# EAGLE schematic DAQ and eCVT (EAGLE 9.5.0)

## Sheet 1 of 3
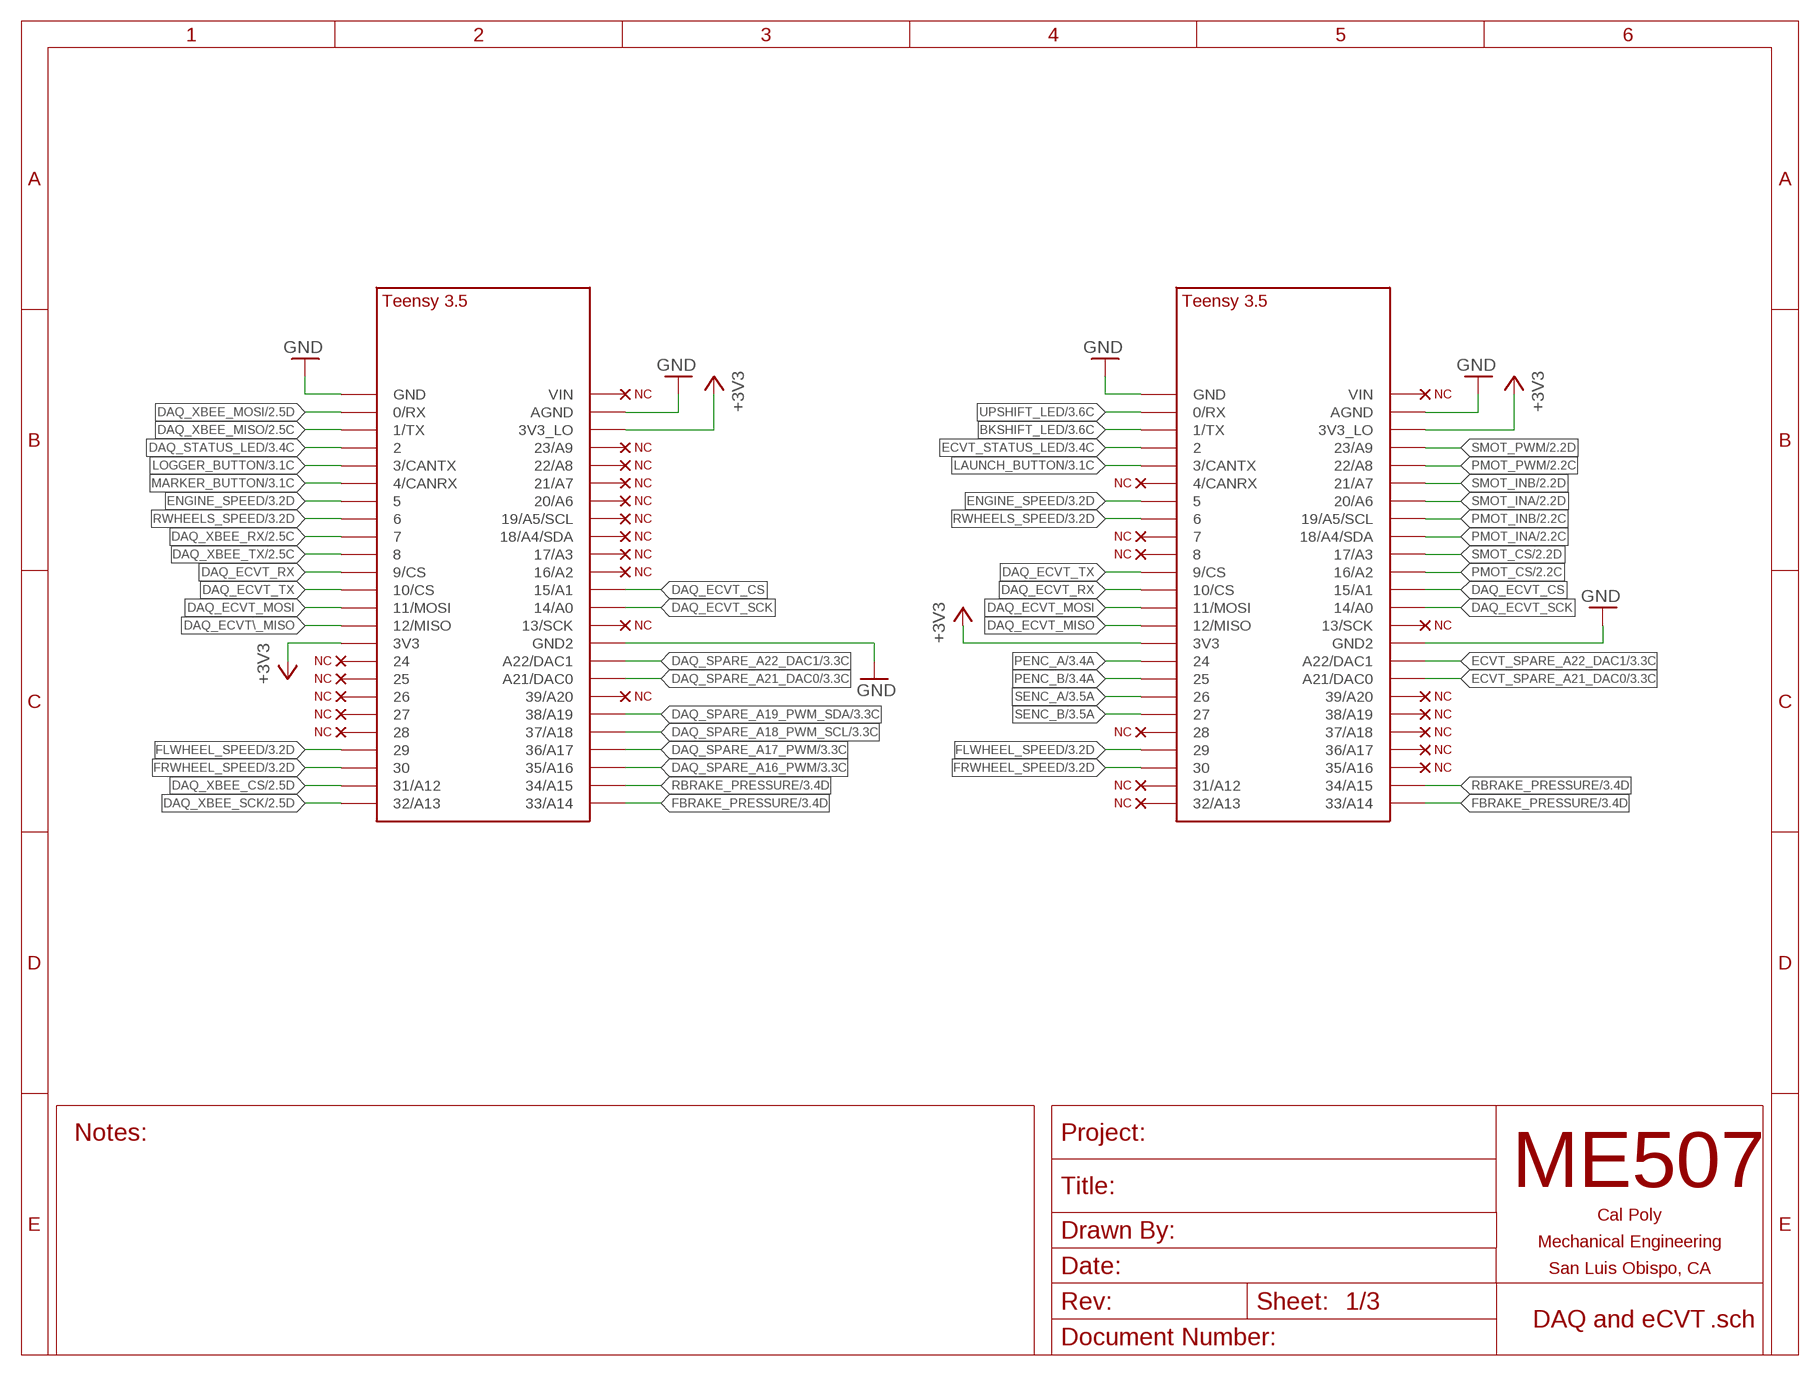
[diagram p0: schematic, sheet 1]

### Parts
U$1  NC  (no package)
U$2  NC  (no package)
U$3  NC  (no package)
U$4  NC  (no package)
U$5  NC  (no package)
U$6  NC  (no package)
U$7  NC  (no package)
U$8  NC  (no package)
U$9  NC  (no package)
U$10  NC  (no package)
U$11  NC  (no package)
U$12  NC  (no package)
U$13  NC  (no package)
U$14  NC  (no package)
U$15  NC  (no package)
U$16  NC  (no package)
U$17  NC  (no package)
U$22  NC  (no package)
U$23  NC  (no package)
U$24  NC  (no package)
U$25  NC  (no package)
U$26  NC  (no package)
U$27  NC  (no package)
U$31  TEENSY_3.5_BAJA  [TEENSY_3.5_BAJA]
U$32  NC  (no package)
U$33  TEENSY_3.5_BAJA  [TEENSY_3.5_BAJA]
U$40  NC  (no package)
U$41  NC  (no package)
U$42  NC  (no package)
U$55  NC  (no package)
U$56  NC  (no package)

### Nets
+3V3: U$31.3V3_LO U$33.3V3_LO ; also sheet 2,3
BKSHIFT_LED: U$33.1/TX ; also sheet 3
DAQ_ECVT\_MISO: U$31.12/MISO
DAQ_ECVT_CS: U$31.15/A1 U$33.15/A1
DAQ_ECVT_MISO: U$33.12/MISO
DAQ_ECVT_MOSI: U$31.11/MOSI U$33.11/MOSI
DAQ_ECVT_RX: U$31.9/CS U$33.10/CS
DAQ_ECVT_SCK: U$31.14/A0 U$33.14/A0
DAQ_ECVT_TX: U$31.10/CS U$33.9/CS
DAQ_SPARE_A16_PWM: U$31.35/A16 ; also sheet 3
DAQ_SPARE_A17_PWM: U$31.36/A17 ; also sheet 3
DAQ_SPARE_A18_PWM_SCL: U$31.37/A18 ; also sheet 3
DAQ_SPARE_A19_PWM_SDA: U$31.38/A19 ; also sheet 3
DAQ_SPARE_A21_DAC0: U$31.21/DAC0(A21/DAC0) ; also sheet 3
DAQ_SPARE_A22_DAC1: U$31.A22/DAC1 ; also sheet 3
DAQ_STATUS_LED: U$31.2 ; also sheet 3
DAQ_XBEE_CS: U$31.31/A12 ; also sheet 2
DAQ_XBEE_MISO: U$31.1/TX ; also sheet 2
DAQ_XBEE_MOSI: U$31.0/RX ; also sheet 2
DAQ_XBEE_RX: U$31.7 ; also sheet 2
DAQ_XBEE_SCK: U$31.32/A13 ; also sheet 2
DAQ_XBEE_TX: U$31.8 ; also sheet 2
ECVT_SPARE_A21_DAC0: U$33.21/DAC0(A21/DAC0) ; also sheet 3
ECVT_SPARE_A22_DAC1: U$33.A22/DAC1 ; also sheet 3
ECVT_STATUS_LED: U$33.2 ; also sheet 3
ENGINE_SPEED: U$31.5 U$33.5 ; also sheet 3
FBRAKE_PRESSURE: U$31.33/A14 U$33.33/A14 ; also sheet 3
FLWHEEL_SPEED: U$31.29 U$33.29 ; also sheet 3
FRWHEEL_SPEED: U$31.30 U$33.30 ; also sheet 3
GND: U$31.AGND U$31.GND U$31.GND2 U$33.AGND U$33.GND U$33.GND2 ; also sheet 2,3
LAUNCH_BUTTON: U$33.3/CANTX ; also sheet 3
LOGGER_BUTTON: U$31.3/CANTX ; also sheet 3
MARKER_BUTTON: U$31.4/CANRX ; also sheet 3
N$2: U$31.3V3 ; supply symbol labelled +3V3
N$3: U$4.D U$31.13/SCK
N$4: U$5.D U$31.16/A2
N$5: U$6.D U$31.17/A3
N$6: U$7.D U$31.18/A4/SDA
N$7: U$8.D U$31.19/A5/SCL
N$8: U$9.D U$31.20/A6
N$9: U$10.D U$31.21/A7
N$10: U$11.D U$31.22/A8
N$11: U$12.D U$31.23/A9
N$12: U$13.D U$31.24
N$13: U$14.D U$31.25
N$14: U$15.D U$31.26
N$15: U$16.D U$31.27
N$16: U$17.D U$31.28
N$17: U$22.D U$31.39/A20
N$18: U$31.VIN U$56.D
N$19: U$33.3V3 ; supply symbol labelled +3V3
N$20: U$3.D U$33.13/SCK
N$22: U$33.39/A20 U$40.D
N$23: U$33.7 U$41.D
N$24: U$33.8 U$42.D
N$25: U$23.D U$33.28
N$26: U$24.D U$33.35/A16
N$27: U$25.D U$33.36/A17
N$28: U$26.D U$33.37/A18
N$29: U$27.D U$33.38/A19
N$30: U$33.VIN U$55.D
N$31: U$1.D U$33.4/CANRX
N$32: U$2.D U$33.31/A12
N$33: U$32.D U$33.32/A13
PENC_A: U$33.24 ; also sheet 3
PENC_B: U$33.25 ; also sheet 3
PMOT_CS: U$33.16/A2 ; also sheet 2
PMOT_INA: U$33.18/A4/SDA ; also sheet 2
PMOT_INB: U$33.19/A5/SCL ; also sheet 2
PMOT_PWM: U$33.22/A8 ; also sheet 2
RBRAKE_PRESSURE: U$31.34/A15 U$33.34/A15 ; also sheet 3
RWHEELS_SPEED: U$31.6 U$33.6 ; also sheet 3
SENC_A: U$33.26 ; also sheet 3
SENC_B: U$33.27 ; also sheet 3
SMOT_CS: U$33.17/A3 ; also sheet 2
SMOT_INA: U$33.20/A6 ; also sheet 2
SMOT_INB: U$33.21/A7 ; also sheet 2
SMOT_PWM: U$33.23/A9 ; also sheet 2
UPSHIFT_LED: U$33.0/RX ; also sheet 3

## Sheet 2 of 3
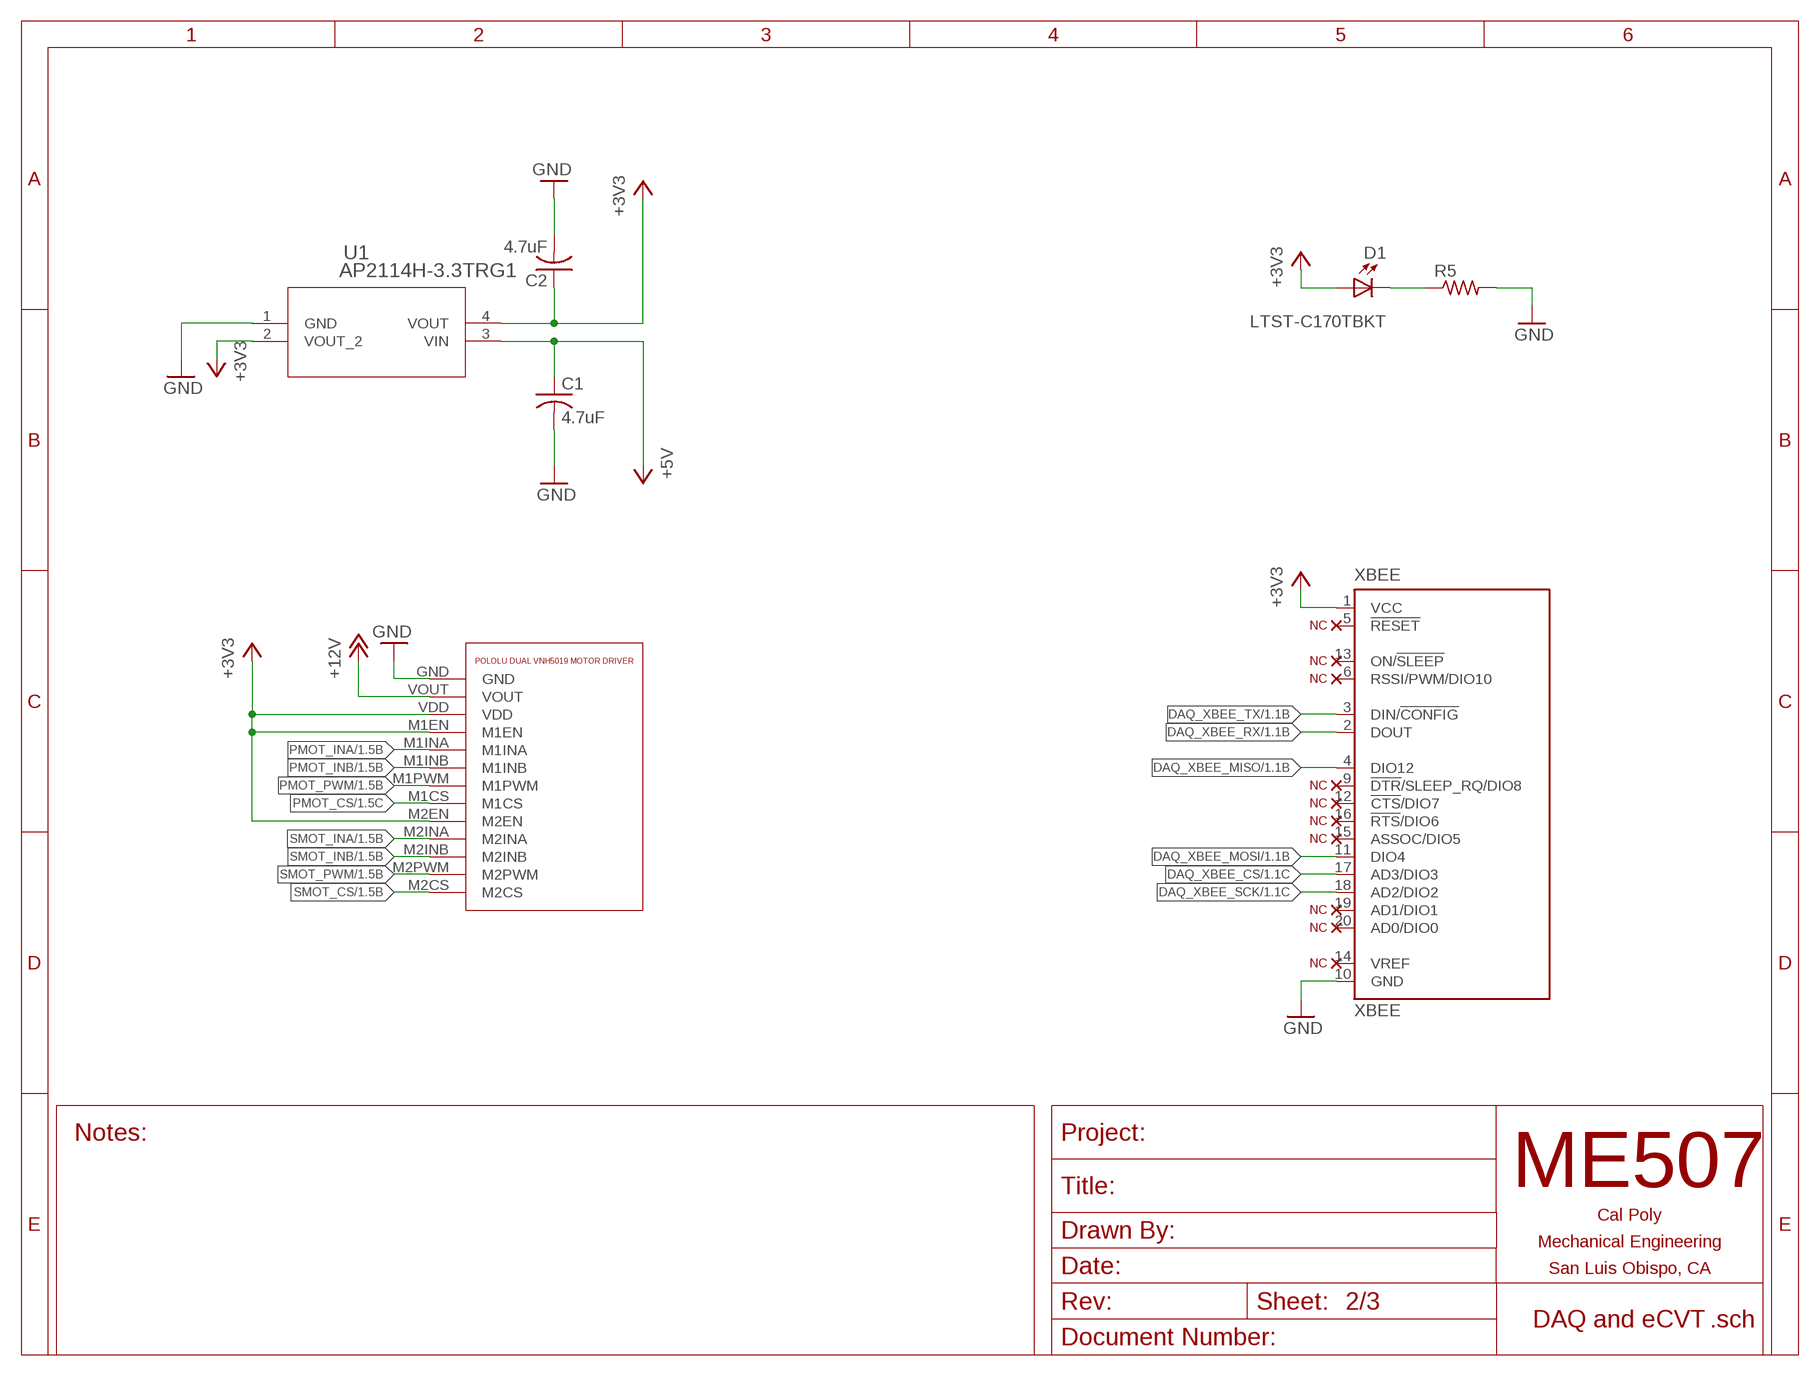
[diagram p1: schematic, sheet 2]

### Parts
C1  4.7uF  C-USC0805  [C0805]
C2  4.7uF  C-USC0805  [C0805]
D1  LTST-C170TBKT  [DIOC200X125X110]
R5  R-US_R0805  [R0805]
U1  AP2114H-3.3TRG1  [SOT-223]
U$28  POLOLU_DUAL_VNH5019_BAJA  [POLOLU_DUAL_VNH5019_BAJA]
U$34  NC  (no package)
U$35  NC  (no package)
U$47  NC  (no package)
U$48  NC  (no package)
U$49  NC  (no package)
U$50  NC  (no package)
U$51  NC  (no package)
U$52  NC  (no package)
U$53  NC  (no package)
U$54  NC  (no package)
XBEE  XBEE  [XBEE]

### Nets
+3V3: C2.1 D1.+ U1.2(VOUT_2) U1.4(VOUT) U$28.M1EN U$28.M2EN U$28.VDD XBEE.1(VCC) ; also sheet 1,3
+5V: C1.1 U1.3(VIN) ; also sheet 3
+12V: U$28.VOUT ; also sheet 3
DAQ_XBEE_CS: XBEE.17(AD3/DIO3) ; also sheet 1
DAQ_XBEE_MISO: XBEE.4(DIO12) ; also sheet 1
DAQ_XBEE_MOSI: XBEE.11(DIO4) ; also sheet 1
DAQ_XBEE_RX: XBEE.2(DOUT) ; also sheet 1
DAQ_XBEE_SCK: XBEE.18(AD2/DIO2) ; also sheet 1
DAQ_XBEE_TX: XBEE.3(DIN/!CONFIG) ; also sheet 1
GND: C1.2 C2.2 R5.2 U1.1(GND) U$28.GND XBEE.10(GND) ; also sheet 1,3
N$34: D1.- R5.1
N$43: U$34.D XBEE.5(!RESET)
N$45: U$35.D XBEE.13(ON/!SLEEP)
N$46: U$47.D XBEE.6(RSSI/PWM/DIO10)
N$47: U$48.D XBEE.9(!DTR!/SLEEP_RQ/DIO8)
N$48: U$49.D XBEE.12(!CTS!/DIO7)
N$49: U$50.D XBEE.16(!RTS!/DIO6)
N$50: U$51.D XBEE.15(ASSOC/DIO5)
N$51: U$52.D XBEE.19(AD1/DIO1)
N$52: U$53.D XBEE.20(AD0/DIO0)
N$53: U$54.D XBEE.14(VREF)
PMOT_CS: U$28.M1CS ; also sheet 1
PMOT_INA: U$28.M1INA ; also sheet 1
PMOT_INB: U$28.M1INB ; also sheet 1
PMOT_PWM: U$28.M1PWM ; also sheet 1
SMOT_CS: U$28.M2CS ; also sheet 1
SMOT_INA: U$28.M2INA ; also sheet 1
SMOT_INB: U$28.M2INB ; also sheet 1
SMOT_PWM: U$28.M2PWM ; also sheet 1

## Sheet 3 of 3
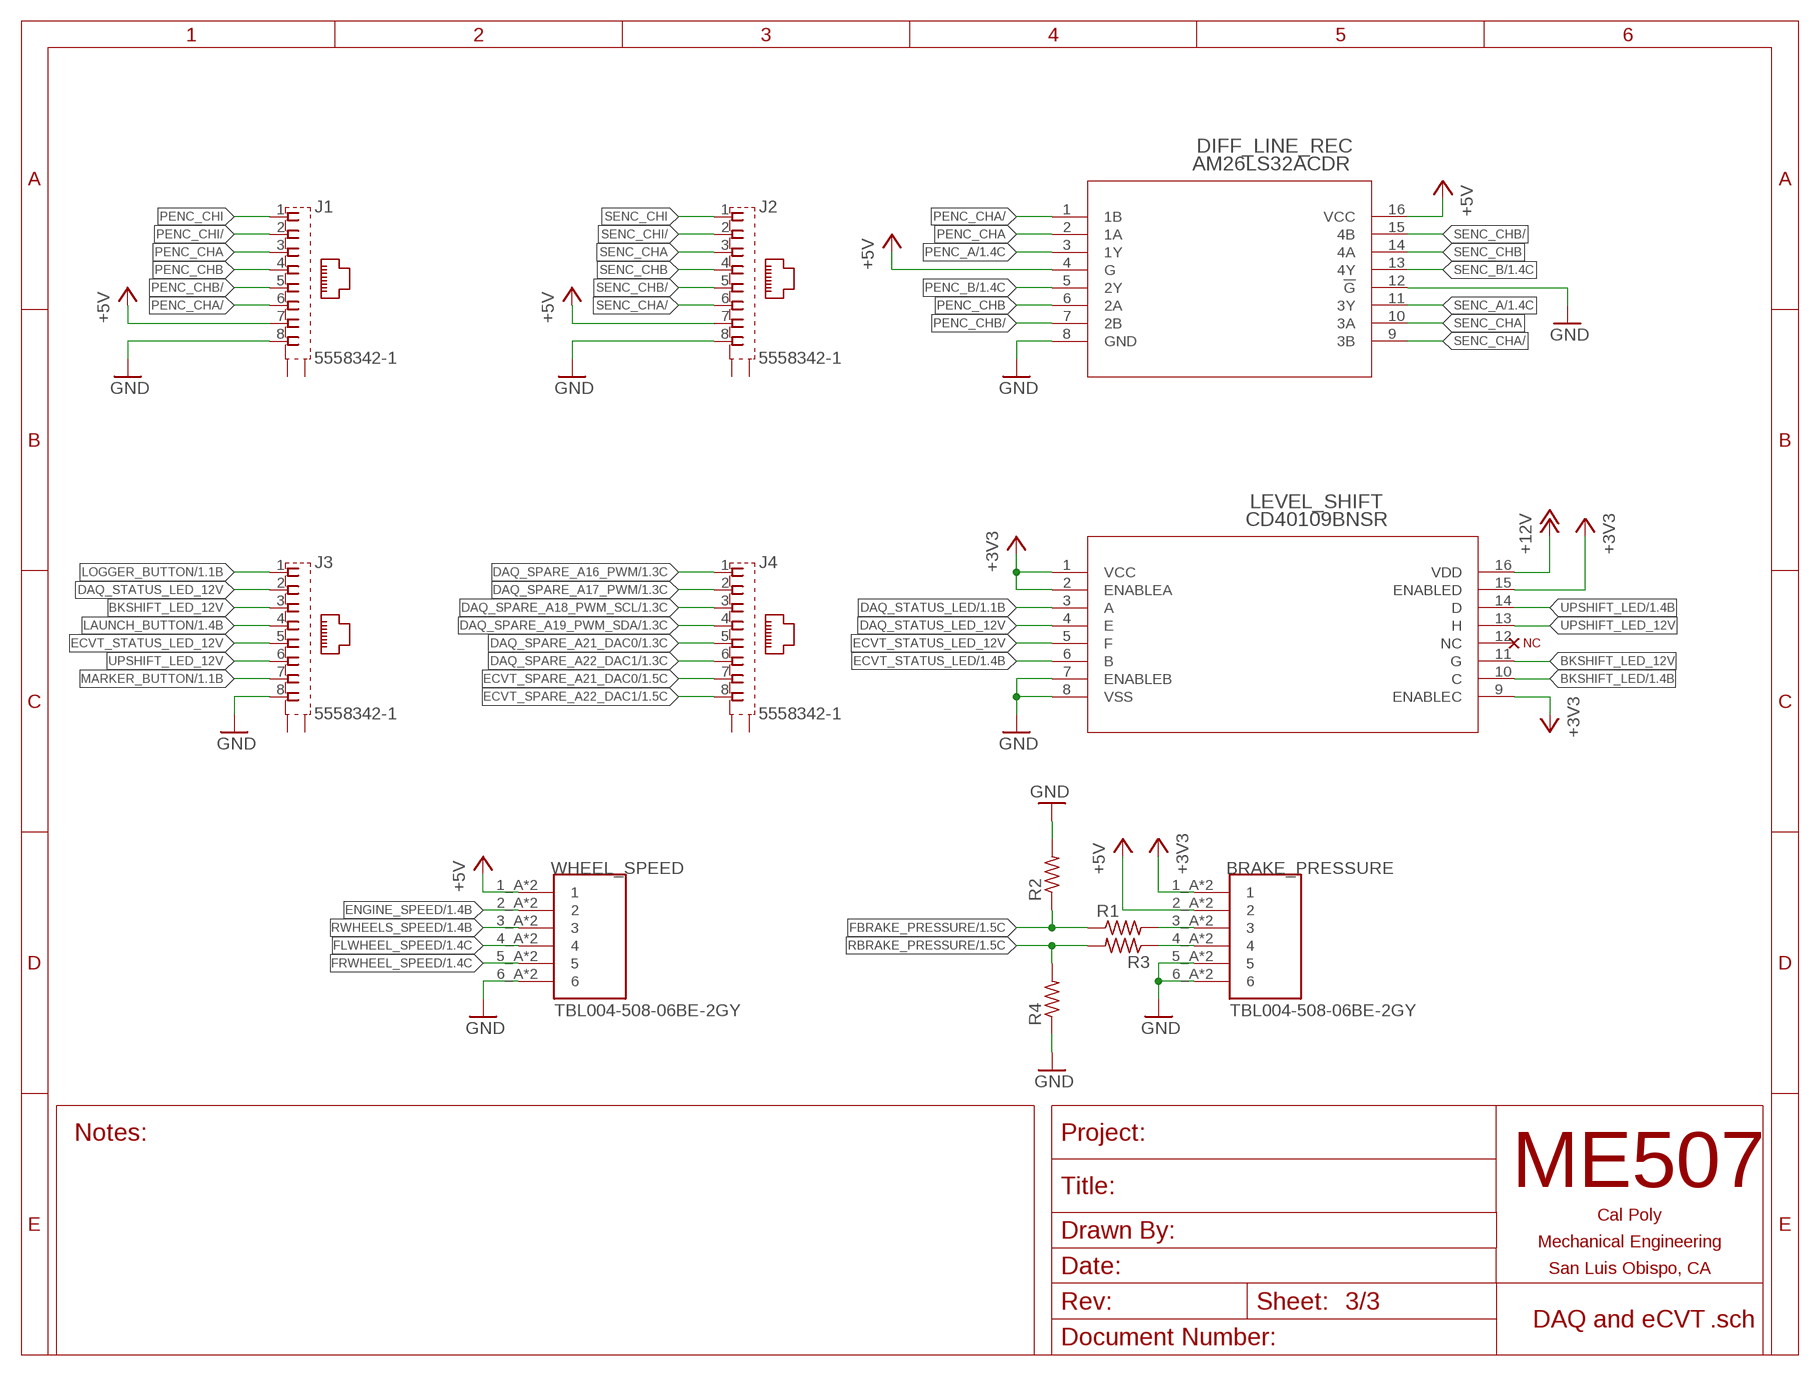
[diagram p2: schematic, sheet 3]

### Parts
BRAKE_PRESSURE  TBL004-508-06BE-2GY  [CUI_TBL004-508-06BE-2GY]
DIFF_LINE_REC  AM26LS32ACDR  [D16]
J1  5558342-1  [TE_5558342-1]
J2  5558342-1  [TE_5558342-1]
J3  5558342-1  [TE_5558342-1]
J4  5558342-1  [TE_5558342-1]
LEVEL_SHIFT  CD40109BNSR  [NS16]
R1  R-US_0204/7  [0204/7]
R2  R-US_0204/7  [0204/7]
R3  R-US_0204/7  [0204/7]
R4  R-US_0204/7  [0204/7]
U$30  NC  (no package)
WHEEL_SPEED  TBL004-508-06BE-2GY  [CUI_TBL004-508-06BE-2GY]

### Nets
+3V3: BRAKE_PRESSURE.1_A BRAKE_PRESSURE.1_B LEVEL_SHIFT.1(VCC) LEVEL_SHIFT.2(ENABLEA) LEVEL_SHIFT.9(ENABLEC) LEVEL_SHIFT.15(ENABLED) ; also sheet 1,2
+5V: BRAKE_PRESSURE.2_A BRAKE_PRESSURE.2_B DIFF_LINE_REC.4(G) DIFF_LINE_REC.16(VCC) J1.7 J2.7 WHEEL_SPEED.1_A WHEEL_SPEED.1_B ; also sheet 2
+12V: LEVEL_SHIFT.16(VDD) ; also sheet 2
BKSHIFT_LED: LEVEL_SHIFT.10(C) ; also sheet 1
BKSHIFT_LED_12V: J3.3 LEVEL_SHIFT.11(G)
DAQ_SPARE_A16_PWM: J4.1 ; also sheet 1
DAQ_SPARE_A17_PWM: J4.2 ; also sheet 1
DAQ_SPARE_A18_PWM_SCL: J4.3 ; also sheet 1
DAQ_SPARE_A19_PWM_SDA: J4.4 ; also sheet 1
DAQ_SPARE_A21_DAC0: J4.5 ; also sheet 1
DAQ_SPARE_A22_DAC1: J4.6 ; also sheet 1
DAQ_STATUS_LED: LEVEL_SHIFT.3(A) ; also sheet 1
DAQ_STATUS_LED_12V: J3.2 LEVEL_SHIFT.4(E)
ECVT_SPARE_A21_DAC0: J4.7 ; also sheet 1
ECVT_SPARE_A22_DAC1: J4.8 ; also sheet 1
ECVT_STATUS_LED: LEVEL_SHIFT.6(B) ; also sheet 1
ECVT_STATUS_LED_12V: J3.5 LEVEL_SHIFT.5(F)
ENGINE_SPEED: WHEEL_SPEED.2_A WHEEL_SPEED.2_B ; also sheet 1
FBRAKE_PRESSURE: R1.1 R2.1 ; also sheet 1
FBRAKE_PRESSURE_W/O_RES: BRAKE_PRESSURE.3_A BRAKE_PRESSURE.3_B R1.2
FLWHEEL_SPEED: WHEEL_SPEED.4_A WHEEL_SPEED.4_B ; also sheet 1
FRWHEEL_SPEED: WHEEL_SPEED.5_A WHEEL_SPEED.5_B ; also sheet 1
GND: BRAKE_PRESSURE.5_A BRAKE_PRESSURE.5_B BRAKE_PRESSURE.6_A BRAKE_PRESSURE.6_B DIFF_LINE_REC.8(GND) DIFF_LINE_REC.12(!G) J1.8 J2.8 J3.8 LEVEL_SHIFT.7(ENABLEB) LEVEL_SHIFT.8(VSS) R2.2 R4.1 WHEEL_SPEED.6_A WHEEL_SPEED.6_B ; also sheet 1,2
LAUNCH_BUTTON: J3.4 ; also sheet 1
LOGGER_BUTTON: J3.1 ; also sheet 1
MARKER_BUTTON: J3.7 ; also sheet 1
N$21: LEVEL_SHIFT.12(NC) U$30.D
PENC_A: DIFF_LINE_REC.3(1Y) ; also sheet 1
PENC_B: DIFF_LINE_REC.5(2Y) ; also sheet 1
PENC_CHA: DIFF_LINE_REC.2(1A) J1.3
PENC_CHA/: DIFF_LINE_REC.1(1B) J1.6
PENC_CHB: DIFF_LINE_REC.6(2A) J1.4
PENC_CHB/: DIFF_LINE_REC.7(2B) J1.5
PENC_CHI: J1.1
PENC_CHI/: J1.2
RBRAKE_PRESSURE: R3.2 R4.2 ; also sheet 1
RBRAKE_PRESSURE_W/O_RES: BRAKE_PRESSURE.4_A BRAKE_PRESSURE.4_B R3.1
RWHEELS_SPEED: WHEEL_SPEED.3_A WHEEL_SPEED.3_B ; also sheet 1
SENC_A: DIFF_LINE_REC.11(3Y) ; also sheet 1
SENC_B: DIFF_LINE_REC.13(4Y) ; also sheet 1
SENC_CHA: DIFF_LINE_REC.10(3A) J2.3
SENC_CHA/: DIFF_LINE_REC.9(3B) J2.6
SENC_CHB: DIFF_LINE_REC.14(4A) J2.4
SENC_CHB/: DIFF_LINE_REC.15(4B) J2.5
SENC_CHI: J2.1
SENC_CHI/: J2.2
UPSHIFT_LED: LEVEL_SHIFT.14(D) ; also sheet 1
UPSHIFT_LED_12V: J3.6 LEVEL_SHIFT.13(H)
Unconnected: J1.SH1(S1) J1.SH2(S2) J2.SH1(S1) J2.SH2(S2) J3.SH1(S1) J3.SH2(S2) J4.SH1(S1) J4.SH2(S2)

## Library data of the parts
BRAKE_PRESSURE WHEEL_SPEED = Screwless Terminal 6-Pole:TBL004-508-06BE-2GY; MANUFACTURER: CUI; STANDARD: Manufacturer Recommendations
C1 C2 = rcl:C-US: CAPACITOR, American symbol; SPICEPREFIX: C
D1 = LED:LTST-C170TBKT: Green 2 x 1.25 x 1.1 mm 130° Water Clear 35 mcd 2 V Surface Mount LED; DESCRIPTION: Blue 470nm LED Indication - Discrete 3.3V 0805 _2012 Metric_; DIGI-KEY_PART_NUMBER: 160-1579-1-ND; DIGI-KEY_PURCHASE_URL: https://www.digikey.com/product-detail/en/lite-on-inc/LTST-C170TBKT/160-1579-1-ND/564889?utm_source=snapeda&utm_medium=aggregator&utm_campaign=symbol; MF: Lite-On Inc.; MP: LTST-C170TBKT; PACKAGE: 0805 Lite-On
DIFF_LINE_REC = Quad. Diff. Line Receiver:AM26LS32ACDR; BUILT_BY: EMA_UL_Team; MANUFACTURER: Texas Instruments; MANUFACTURER_PART_NUMBER: AM26LS32ACDR; VENDOR: Texas Instruments
J1-J4 = RJ45:5558342-1: CONN MOD JACK 8P8C R/A SHIELDED; COMMENT: 5558342-1; DESCRIPTION: Conn RJ-45 F 8 POS 2.54mm Solder RA Thru-Hole 8 Terminal 1 Port Cat 5 Box/Tray; DIGI-KEY_PART_NUMBER: A31466-ND; DIGI-KEY_PURCHASE_URL: https://www.digikey.com/product-detail/en/te-connectivity-amp-connectors/5558342-1/A31466-ND/769610?utm_source=snapeda&utm_medium=aggregator&utm_campaign=symbol; EU_ROHS_COMPLIANCE: Compliant; MF: TE Connectivity; MP: 5558342-1; PACKAGE: None; TE_PURCHASE_URL: https://www.te.com/usa-en/product-5558342-1.html?te_bu=Cor&te_type=disp&te_campaign=seda_glo_cor-seda-global-disp-prtnr-fy19-seda-model-bom-cta_sma-317_1&elqCampaignId=32493
LEVEL_SHIFT = Quad. Level Shifter:CD40109BNSR; BUILT_BY: EMA_UL_Team; MANUFACTURER: Texas Instruments; MANUFACTURER_PART_NUMBER: CD40109BNSR; VENDOR: Texas Instruments
R1-R5 = rcl:R-US_: RESISTOR, American symbol; SPICEPREFIX: R
U1 = Voltage Regulator 3.3V:AP2114H-3.3TRG1; BUILT_BY: EMA_UL_Team; MANUFACTURER_PART_NUMBER: AP2114H-3.3TRG1; VENDOR: Diodes Inc
U$1-U$17 U$22-U$27 U$30 U$32 U$34 U$35 U$40-U$42 U$47-U$56 = ME507:NC
U$28 = Pololo Dual VNH5019:POLOLU_DUAL_VNH5019_BAJA
U$31 U$33 = Teensy:TEENSY_3.5_BAJA
XBEE = Xbee:XBEE: XBee (TM) /XBee-PRO(TM) OEM RF Modules Source: MaxStream, Inc. xbee_productmanual.pdf; MPN: XBP24-Z7UIT-004; OC_FARNELL: 1751799; OC_NEWARK: 34R5507